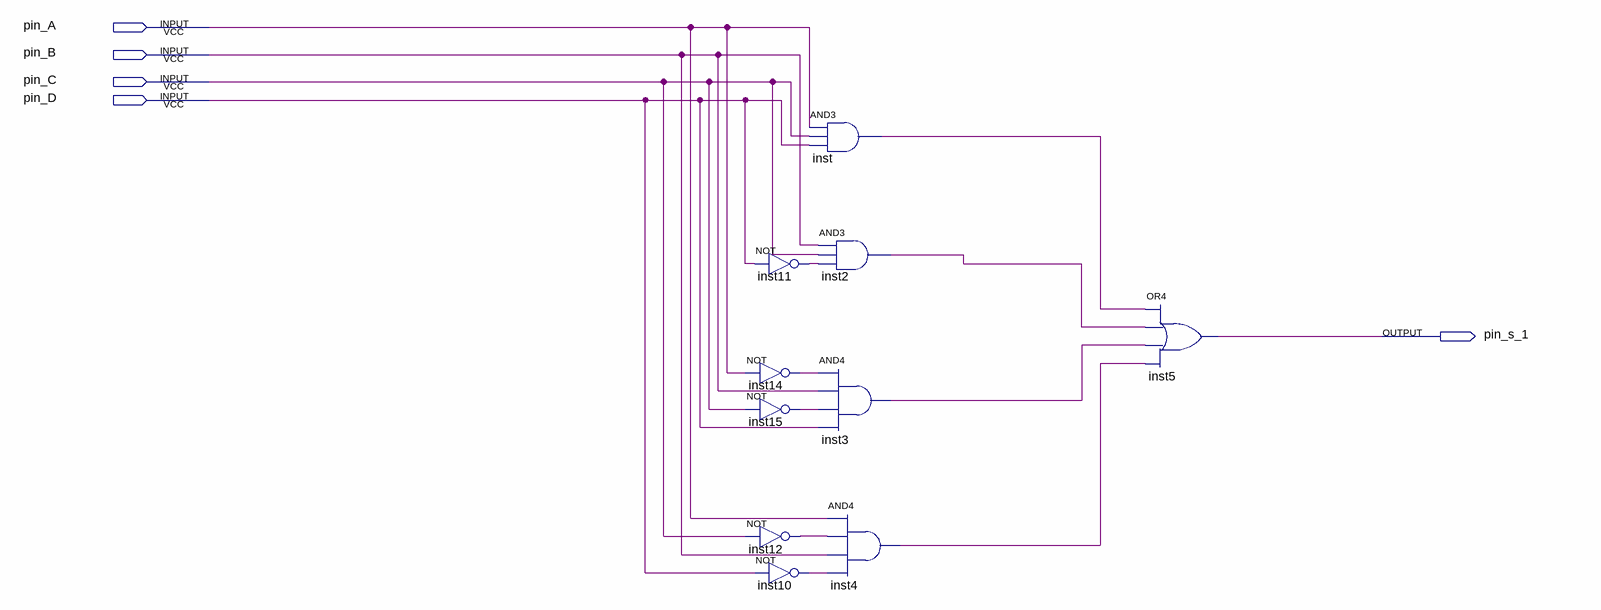
[diagram p0: schematic sheet]
// Quartus schematic s_1.bdf as structural Verilog: 10 symbols, 5 pins
module s_1 (
  input  pin_A,
  input  pin_B,
  input  pin_C,
  input  pin_D,
  output pin_s_1
);

  wire inst2_out, inst3_out, inst4_out, inst10_out, inst11_out, inst12_out, inst14_out, inst15_out, inst_out;

  not inst11 (inst11_out, pin_D);
  not inst14 (inst14_out, pin_A);
  not inst15 (inst15_out, pin_C);
  not inst12 (inst12_out, pin_C);
  not inst10 (inst10_out, pin_D);
  and inst (inst_out, pin_A, pin_C, pin_D);
  and inst2 (inst2_out, pin_B, pin_C, inst11_out);
  and inst3 (inst3_out, inst14_out, pin_B, inst15_out, pin_D);
  and inst4 (inst4_out, pin_A, inst12_out, pin_B, inst10_out);
  or inst5 (pin_s_1, inst_out, inst2_out, inst3_out, inst4_out);
endmodule
